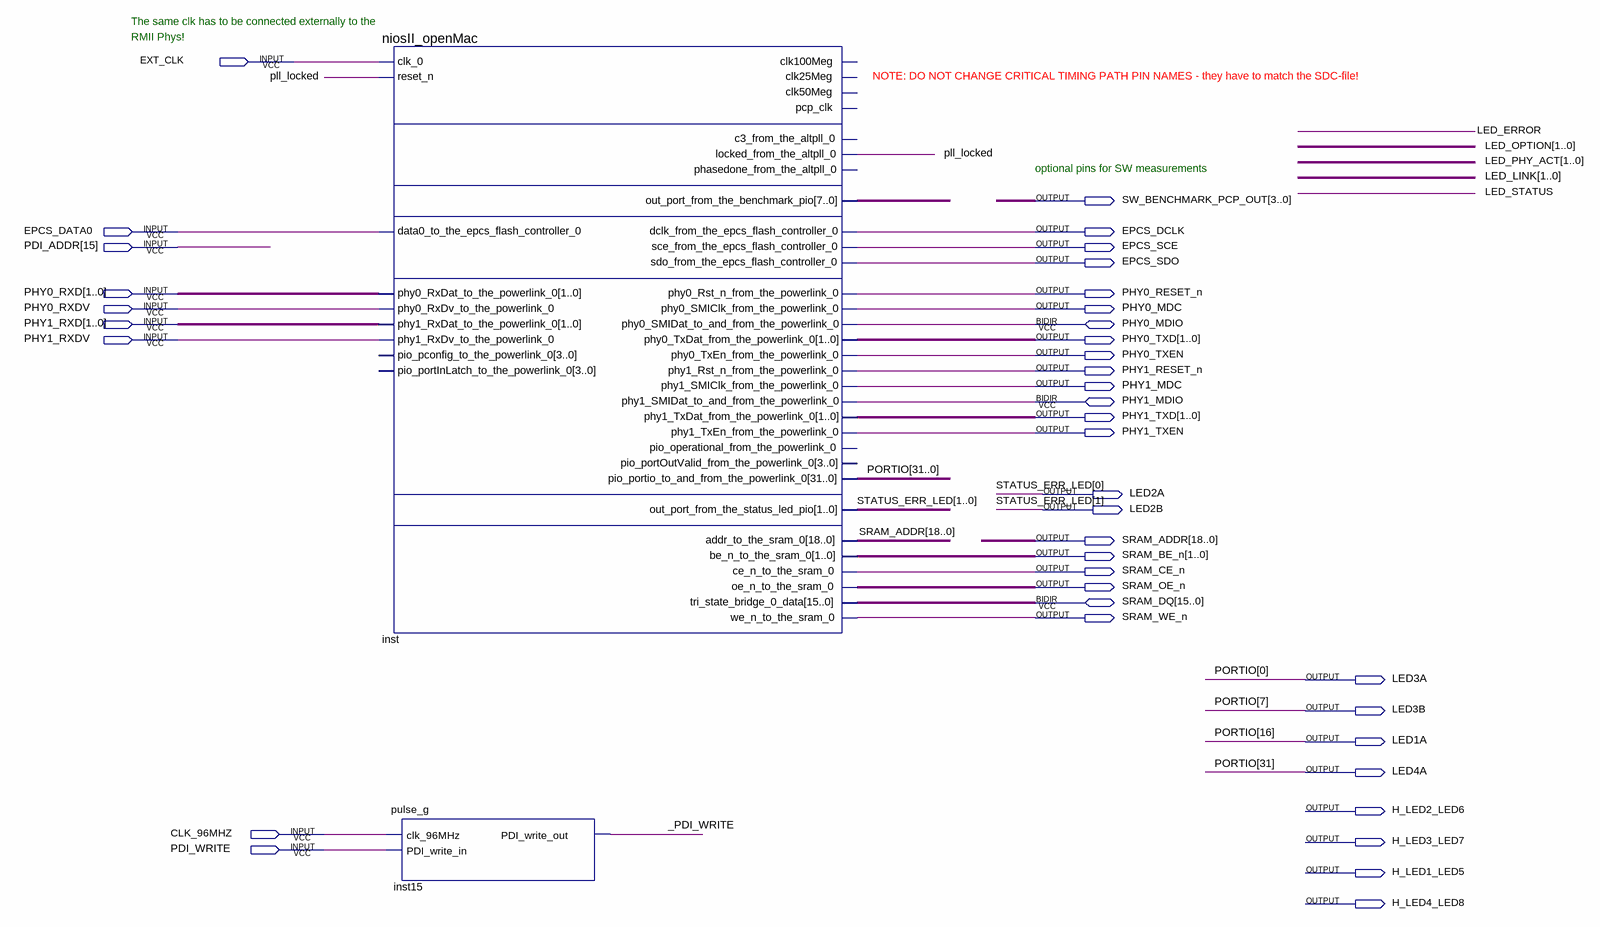
[diagram p0: schematic sheet]
// Quartus schematic nios_pll.bdf as structural Verilog: 2 symbols, 39 pins
module nios_pll (
  input  EXT_CLK,
  input  EPCS_DATA0,
  input  [15:15] PDI_ADDR,
  input  [1:0] PHY0_RXD,
  input  PHY0_RXDV,
  input  [1:0] PHY1_RXD,
  input  PHY1_RXDV,
  input  CLK_96MHZ,
  input  PDI_WRITE,
  inout  PHY0_MDIO,
  inout  PHY1_MDIO,
  inout  [15:0] SRAM_DQ,
  output [3:0] SW_BENCHMARK_PCP_OUT,
  output EPCS_DCLK,
  output EPCS_SCE,
  output EPCS_SDO,
  output PHY0_RESET_n,
  output PHY0_MDC,
  output [1:0] PHY0_TXD,
  output PHY0_TXEN,
  output PHY1_RESET_n,
  output PHY1_MDC,
  output [1:0] PHY1_TXD,
  output PHY1_TXEN,
  output LED2A,
  output LED2B,
  output [18:0] SRAM_ADDR,
  output [1:0] SRAM_BE_n,
  output SRAM_CE_n,
  output SRAM_OE_n,
  output SRAM_WE_n,
  output LED3A,
  output LED3B,
  output LED1A,
  output LED4A,
  output H_LED2_LED6,
  output H_LED3_LED7,
  output H_LED1_LED5,
  output H_LED4_LED8
);

  wire _PDI_WRITE, pll_locked;
  wire [7:0] inst_out_port_from_the_benchmark_pio;
  wire [30:1] PORTIO;

  niosII_openMac inst (
    .clk_0(EXT_CLK), .reset_n(pll_locked), .data0_to_the_epcs_flash_controller_0(EPCS_DATA0),
    .phy0_RxDat_to_the_powerlink_0(PHY0_RXD), .phy0_RxDv_to_the_powerlink_0(PHY0_RXDV),
    .phy1_RxDat_to_the_powerlink_0(PHY1_RXD), .phy1_RxDv_to_the_powerlink_0(PHY1_RXDV),
    .locked_from_the_altpll_0(pll_locked),
    .out_port_from_the_benchmark_pio(inst_out_port_from_the_benchmark_pio),
    .dclk_from_the_epcs_flash_controller_0(EPCS_DCLK), .sce_from_the_epcs_flash_controller_0(EPCS_SCE),
    .sdo_from_the_epcs_flash_controller_0(EPCS_SDO), .phy0_Rst_n_from_the_powerlink_0(PHY0_RESET_n),
    .phy0_SMIClk_from_the_powerlink_0(PHY0_MDC), .phy0_TxDat_from_the_powerlink_0(PHY0_TXD),
    .phy0_TxEn_from_the_powerlink_0(PHY0_TXEN), .phy1_Rst_n_from_the_powerlink_0(PHY1_RESET_n),
    .phy1_SMIClk_from_the_powerlink_0(PHY1_MDC), .phy1_TxDat_from_the_powerlink_0(PHY1_TXD),
    .phy1_TxEn_from_the_powerlink_0(PHY1_TXEN), .out_port_from_the_status_led_pio({LED2B, LED2A}),
    .addr_to_the_sram_0(SRAM_ADDR), .be_n_to_the_sram_0(SRAM_BE_n), .ce_n_to_the_sram_0(SRAM_CE_n),
    .oe_n_to_the_sram_0(SRAM_OE_n), .we_n_to_the_sram_0(SRAM_WE_n),
    .phy0_SMIDat_to_and_from_the_powerlink_0(PHY0_MDIO), .phy1_SMIDat_to_and_from_the_powerlink_0(PHY1_MDIO),
    .pio_portio_to_and_from_the_powerlink_0({LED4A, PORTIO[30:17], LED1A, PORTIO[15:8], LED3B, PORTIO[6:1], LED3A}),
    .tri_state_bridge_0_data(SRAM_DQ));  // open: pio_pconfig_to_the_powerlink_0, pio_portInLatch_to_the_powerlink_0, clk100Meg, clk25Meg, clk50Meg, pcp_clk, c3_from_the_altpll_0, phasedone_from_the_altpll_0, pio_operational_from_the_powerlink_0, pio_portOutValid_from_the_powerlink_0
  pulse_g inst15 (.clk_96MHz(CLK_96MHZ), .PDI_write_in(PDI_WRITE), .PDI_write_out(_PDI_WRITE));

  // Other names for the same wires on the sheet: PORTIO (some bits) = {LED4A, LED1A, LED3B, LED3A};
  //   STATUS_ERR_LED[1:0] = {LED2B, LED2A}

  // Notes on the sheet:
  //   The same clk has to be connected externally to the
  //   RMII Phys!
  //   NOTE: DO NOT CHANGE CRITICAL TIMING PATH PIN NAMES - they have to match the SDC-file!
  //   optional pins for SW measurements
endmodule
